# EAGLE design DBCon (EAGLE 8.1.1)
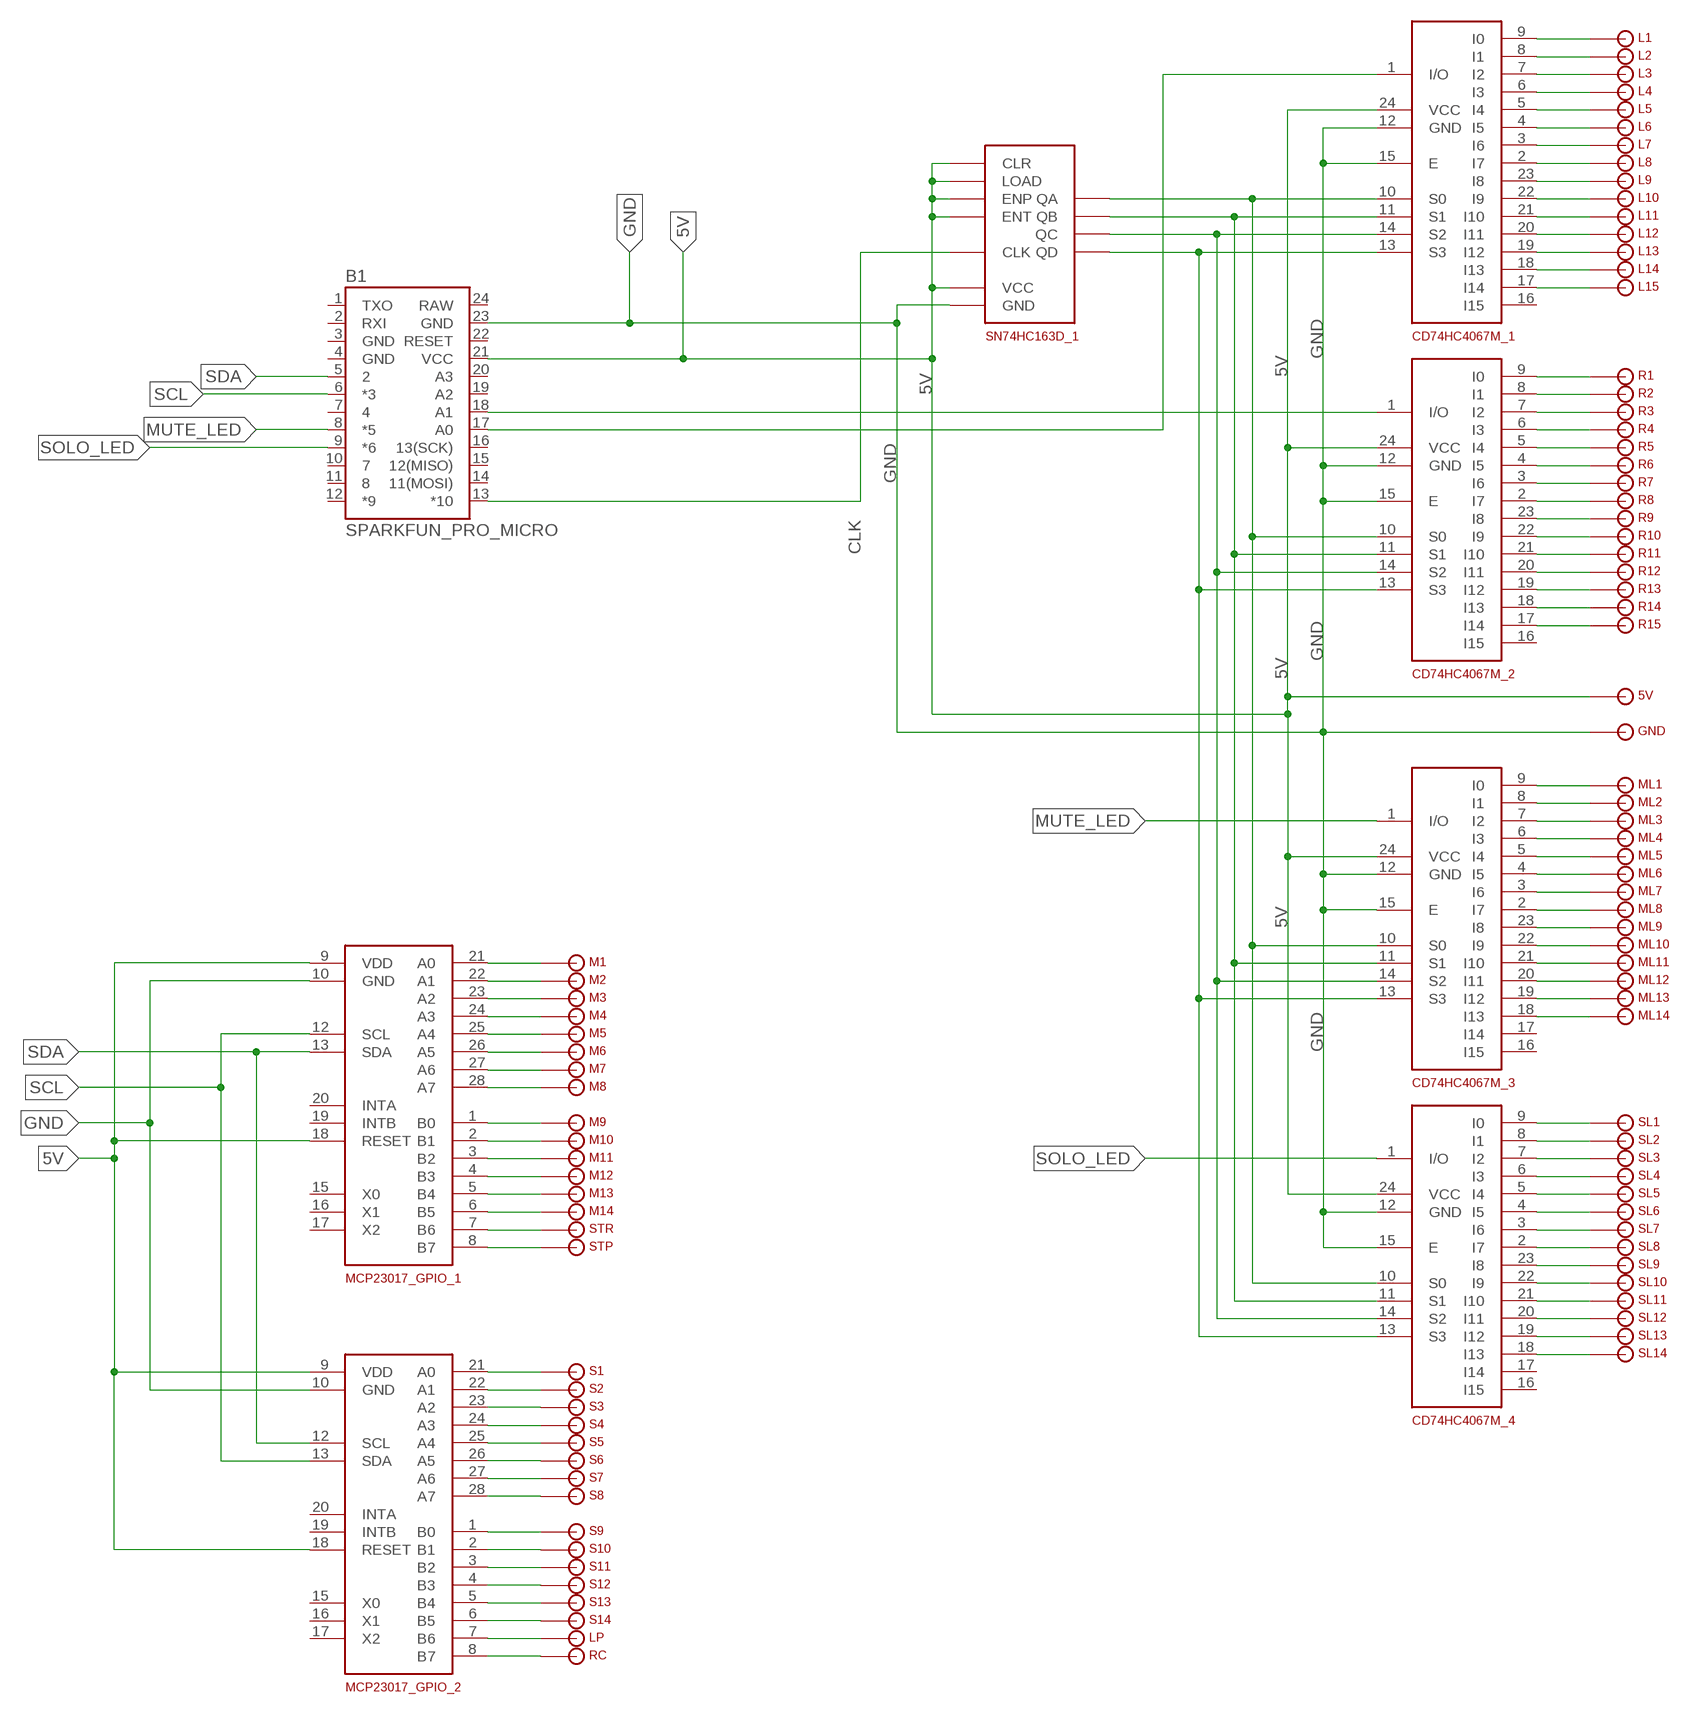
[diagram p0: schematic, sheet 1]

## Parts
5V  1_PIN  [CON1]
B1  SPARKFUN_PRO_MICRO  [SPARKFUN_PRO_MICRO]
CD74HC4067M_1  CD74HC4067M_DEMUX  [SO24]
CD74HC4067M_2  CD74HC4067M_DEMUX  [SO24]
CD74HC4067M_3  CD74HC4067M_DEMUX  [SO24]
CD74HC4067M_4  CD74HC4067M_DEMUX  [SO24]
GND  1_PIN  [CON1]
L1  1_PIN  [CON1]
L2  1_PIN  [CON1]
L3  1_PIN  [CON1]
L4  1_PIN  [CON1]
L5  1_PIN  [CON1]
L6  1_PIN  [CON1]
L7  1_PIN  [CON1]
L8  1_PIN  [CON1]
L9  1_PIN  [CON1]
L10  1_PIN  [CON1]
L11  1_PIN  [CON1]
L12  1_PIN  [CON1]
L13  1_PIN  [CON1]
L14  1_PIN  [CON1]
L15  1_PIN  [CON1]
LP  1_PIN  [CON1]
M1  1_PIN  [CON1]
M2  1_PIN  [CON1]
M3  1_PIN  [CON1]
M4  1_PIN  [CON1]
M5  1_PIN  [CON1]
M6  1_PIN  [CON1]
M7  1_PIN  [CON1]
M8  1_PIN  [CON1]
M9  1_PIN  [CON1]
M10  1_PIN  [CON1]
M11  1_PIN  [CON1]
M12  1_PIN  [CON1]
M13  1_PIN  [CON1]
M14  1_PIN  [CON1]
MCP23017_GPIO_1  MCP23017_GPIO  [DIL28-3]
MCP23017_GPIO_2  MCP23017_GPIO  [DIL28-3]
ML1  1_PIN  [CON1]
ML2  1_PIN  [CON1]
ML3  1_PIN  [CON1]
ML4  1_PIN  [CON1]
ML5  1_PIN  [CON1]
ML6  1_PIN  [CON1]
ML7  1_PIN  [CON1]
ML8  1_PIN  [CON1]
ML9  1_PIN  [CON1]
ML10  1_PIN  [CON1]
ML11  1_PIN  [CON1]
ML12  1_PIN  [CON1]
ML13  1_PIN  [CON1]
ML14  1_PIN  [CON1]
R1  1_PIN  [CON1]
R2  1_PIN  [CON1]
R3  1_PIN  [CON1]
R4  1_PIN  [CON1]
R5  1_PIN  [CON1]
R6  1_PIN  [CON1]
R7  1_PIN  [CON1]
R8  1_PIN  [CON1]
R9  1_PIN  [CON1]
R10  1_PIN  [CON1]
R11  1_PIN  [CON1]
R12  1_PIN  [CON1]
R13  1_PIN  [CON1]
R14  1_PIN  [CON1]
R15  1_PIN  [CON1]
RC  1_PIN  [CON1]
S1  1_PIN  [CON1]
S2  1_PIN  [CON1]
S3  1_PIN  [CON1]
S4  1_PIN  [CON1]
S5  1_PIN  [CON1]
S6  1_PIN  [CON1]
S7  1_PIN  [CON1]
S8  1_PIN  [CON1]
S9  1_PIN  [CON1]
S10  1_PIN  [CON1]
S11  1_PIN  [CON1]
S12  1_PIN  [CON1]
S13  1_PIN  [CON1]
S14  1_PIN  [CON1]
SL1  1_PIN  [CON1]
SL2  1_PIN  [CON1]
SL3  1_PIN  [CON1]
SL4  1_PIN  [CON1]
SL5  1_PIN  [CON1]
SL6  1_PIN  [CON1]
SL7  1_PIN  [CON1]
SL8  1_PIN  [CON1]
SL9  1_PIN  [CON1]
SL10  1_PIN  [CON1]
SL11  1_PIN  [CON1]
SL12  1_PIN  [CON1]
SL13  1_PIN  [CON1]
SL14  1_PIN  [CON1]
SN74HC163D_1  SN74HC163D_COUNTER  [SO16]
STP  1_PIN  [CON1]
STR  1_PIN  [CON1]

## Nets
5V: 5V.P$1(GND) B1.21(VCC) CD74HC4067M_1.24(VCC) CD74HC4067M_2.24(VCC) CD74HC4067M_3.24(VCC) CD74HC4067M_4.24(VCC) MCP23017_GPIO_1.9(VDD) MCP23017_GPIO_1.18(RESET) MCP23017_GPIO_2.9(VDD) MCP23017_GPIO_2.18(RESET) SN74HC163D_1.1(CLR) SN74HC163D_1.7(ENP) SN74HC163D_1.9(LOAD) SN74HC163D_1.10(ENT) SN74HC163D_1.16(VCC)
A: CD74HC4067M_1.10(S0) CD74HC4067M_2.10(S0) CD74HC4067M_3.10(S0) CD74HC4067M_4.10(S0) SN74HC163D_1.14(QA)
B: CD74HC4067M_1.11(S1) CD74HC4067M_2.11(S1) CD74HC4067M_3.11(S1) CD74HC4067M_4.11(S1) SN74HC163D_1.13(QB)
C: CD74HC4067M_1.14(S2) CD74HC4067M_2.14(S2) CD74HC4067M_3.14(S2) CD74HC4067M_4.14(S2) SN74HC163D_1.12(QC)
CLK: B1.13(*10) SN74HC163D_1.2(CLK)
D: CD74HC4067M_1.13(S3) CD74HC4067M_2.13(S3) CD74HC4067M_3.13(S3) CD74HC4067M_4.13(S3) SN74HC163D_1.11(QD)
GND: B1.23(GND) CD74HC4067M_1.12(GND) CD74HC4067M_1.15(E) CD74HC4067M_2.12(GND) CD74HC4067M_2.15(E) CD74HC4067M_3.12(GND) CD74HC4067M_3.15(E) CD74HC4067M_4.12(GND) CD74HC4067M_4.15(E) GND.P$1(GND) MCP23017_GPIO_1.10(GND) MCP23017_GPIO_2.10(GND) SN74HC163D_1.8(GND)
L_IO: B1.17(A0) CD74HC4067M_1.1(I/O)
MUTE_LED: B1.8(*5) CD74HC4067M_3.1(I/O)
N$3: M1.P$1(GND) MCP23017_GPIO_1.21(A0)
N$4: M2.P$1(GND) MCP23017_GPIO_1.22(A1)
N$6: M3.P$1(GND) MCP23017_GPIO_1.23(A2)
N$10: CD74HC4067M_3.9(I0) ML1.P$1(GND)
N$11: CD74HC4067M_3.8(I1) ML2.P$1(GND)
N$12: CD74HC4067M_3.7(I2) ML3.P$1(GND)
N$13: CD74HC4067M_3.6(I3) ML4.P$1(GND)
N$14: M4.P$1(GND) MCP23017_GPIO_1.24(A3)
N$15: M5.P$1(GND) MCP23017_GPIO_1.25(A4)
N$16: CD74HC4067M_1.9(I0) L1.P$1(GND)
N$17: CD74HC4067M_1.8(I1) L2.P$1(GND)
N$18: CD74HC4067M_1.7(I2) L3.P$1(GND)
N$19: CD74HC4067M_1.6(I3) L4.P$1(GND)
N$20: CD74HC4067M_1.5(I4) L5.P$1(GND)
N$21: CD74HC4067M_1.4(I5) L6.P$1(GND)
N$22: CD74HC4067M_1.3(I6) L7.P$1(GND)
N$23: CD74HC4067M_1.2(I7) L8.P$1(GND)
N$24: CD74HC4067M_1.23(I8) L9.P$1(GND)
N$25: CD74HC4067M_1.22(I9) L10.P$1(GND)
N$26: CD74HC4067M_1.21(I10) L11.P$1(GND)
N$27: CD74HC4067M_1.20(I11) L12.P$1(GND)
N$28: CD74HC4067M_1.19(I12) L13.P$1(GND)
N$29: CD74HC4067M_1.18(I13) L14.P$1(GND)
N$30: CD74HC4067M_1.17(I14) L15.P$1(GND)
N$31: CD74HC4067M_2.9(I0) R1.P$1(GND)
N$32: CD74HC4067M_2.8(I1) R2.P$1(GND)
N$33: CD74HC4067M_2.7(I2) R3.P$1(GND)
N$34: CD74HC4067M_2.6(I3) R4.P$1(GND)
N$35: CD74HC4067M_2.5(I4) R5.P$1(GND)
N$36: CD74HC4067M_2.4(I5) R6.P$1(GND)
N$37: CD74HC4067M_2.3(I6) R7.P$1(GND)
N$38: CD74HC4067M_2.2(I7) R8.P$1(GND)
N$39: CD74HC4067M_2.23(I8) R9.P$1(GND)
N$40: CD74HC4067M_2.22(I9) R10.P$1(GND)
N$41: CD74HC4067M_2.21(I10) R11.P$1(GND)
N$42: CD74HC4067M_2.20(I11) R12.P$1(GND)
N$43: CD74HC4067M_2.19(I12) R13.P$1(GND)
N$44: CD74HC4067M_2.18(I13) R14.P$1(GND)
N$45: CD74HC4067M_2.17(I14) R15.P$1(GND)
N$46: M6.P$1(GND) MCP23017_GPIO_1.26(A5)
N$47: M7.P$1(GND) MCP23017_GPIO_1.27(A6)
N$48: M8.P$1(GND) MCP23017_GPIO_1.28(A7)
N$49: M9.P$1(GND) MCP23017_GPIO_1.1(B0)
N$50: M10.P$1(GND) MCP23017_GPIO_1.2(B1)
N$51: M11.P$1(GND) MCP23017_GPIO_1.3(B2)
N$52: M12.P$1(GND) MCP23017_GPIO_1.4(B3)
N$53: M13.P$1(GND) MCP23017_GPIO_1.5(B4)
N$54: M14.P$1(GND) MCP23017_GPIO_1.6(B5)
N$55: MCP23017_GPIO_1.7(B6) STR.P$1(GND)
N$56: MCP23017_GPIO_1.8(B7) STP.P$1(GND)
N$57: MCP23017_GPIO_2.21(A0) S1.P$1(GND)
N$58: MCP23017_GPIO_2.22(A1) S2.P$1(GND)
N$59: MCP23017_GPIO_2.23(A2) S3.P$1(GND)
N$60: MCP23017_GPIO_2.24(A3) S4.P$1(GND)
N$61: MCP23017_GPIO_2.25(A4) S5.P$1(GND)
N$62: MCP23017_GPIO_2.26(A5) S6.P$1(GND)
N$63: MCP23017_GPIO_2.27(A6) S7.P$1(GND)
N$64: MCP23017_GPIO_2.28(A7) S8.P$1(GND)
N$65: MCP23017_GPIO_2.1(B0) S9.P$1(GND)
N$66: MCP23017_GPIO_2.2(B1) S10.P$1(GND)
N$67: MCP23017_GPIO_2.3(B2) S11.P$1(GND)
N$68: MCP23017_GPIO_2.4(B3) S12.P$1(GND)
N$69: MCP23017_GPIO_2.5(B4) S13.P$1(GND)
N$70: MCP23017_GPIO_2.6(B5) S14.P$1(GND)
N$71: LP.P$1(GND) MCP23017_GPIO_2.7(B6)
N$72: MCP23017_GPIO_2.8(B7) RC.P$1(GND)
N$73: CD74HC4067M_3.5(I4) ML5.P$1(GND)
N$74: CD74HC4067M_3.4(I5) ML6.P$1(GND)
N$75: CD74HC4067M_3.3(I6) ML7.P$1(GND)
N$76: CD74HC4067M_3.2(I7) ML8.P$1(GND)
N$77: CD74HC4067M_3.23(I8) ML9.P$1(GND)
N$78: CD74HC4067M_3.22(I9) ML10.P$1(GND)
N$79: CD74HC4067M_3.21(I10) ML11.P$1(GND)
N$80: CD74HC4067M_3.20(I11) ML12.P$1(GND)
N$81: CD74HC4067M_3.19(I12) ML13.P$1(GND)
N$82: CD74HC4067M_3.18(I13) ML14.P$1(GND)
N$83: CD74HC4067M_4.9(I0) SL1.P$1(GND)
N$84: CD74HC4067M_4.8(I1) SL2.P$1(GND)
N$85: CD74HC4067M_4.7(I2) SL3.P$1(GND)
N$86: CD74HC4067M_4.6(I3) SL4.P$1(GND)
N$87: CD74HC4067M_4.5(I4) SL5.P$1(GND)
N$88: CD74HC4067M_4.4(I5) SL6.P$1(GND)
N$89: CD74HC4067M_4.3(I6) SL7.P$1(GND)
N$90: CD74HC4067M_4.2(I7) SL8.P$1(GND)
N$91: CD74HC4067M_4.23(I8) SL9.P$1(GND)
N$92: CD74HC4067M_4.22(I9) SL10.P$1(GND)
N$93: CD74HC4067M_4.21(I10) SL11.P$1(GND)
N$94: CD74HC4067M_4.20(I11) SL12.P$1(GND)
N$95: CD74HC4067M_4.19(I12) SL13.P$1(GND)
N$96: CD74HC4067M_4.18(I13) SL14.P$1(GND)
R_IO: B1.18(A1) CD74HC4067M_2.1(I/O)
SCL: B1.6(*3) MCP23017_GPIO_1.12(SCL) MCP23017_GPIO_2.13(SDA)
SDA: B1.5 MCP23017_GPIO_1.13(SDA) MCP23017_GPIO_2.12(SCL)
SOLO_LED: B1.9(*6) CD74HC4067M_4.1(I/O)
Unconnected: B1.1(TXO) B1.2(RXI) B1.7 B1.10 B1.11 B1.12(*9) B1.14(11(MOSI)) B1.15(12(MISO)) B1.16(13(SCK)) B1.19(A2) B1.20(A3) B1.22(RESET) CD74HC4067M_1.16(I15) CD74HC4067M_2.16(I15) CD74HC4067M_3.16(I15) CD74HC4067M_3.17(I14) CD74HC4067M_4.16(I15) CD74HC4067M_4.17(I14) MCP23017_GPIO_1.15(X0) MCP23017_GPIO_1.16(X1) MCP23017_GPIO_1.17(X2) MCP23017_GPIO_1.19(INTB) MCP23017_GPIO_1.20(INTA) MCP23017_GPIO_2.15(X0) MCP23017_GPIO_2.16(X1) MCP23017_GPIO_2.17(X2) MCP23017_GPIO_2.19(INTB) MCP23017_GPIO_2.20(INTA)

## Power pins joined to a net without a drawn wire
GND: B1.3(GND) B1.4(GND)
RAW: B1.24(RAW)

## Library data of the parts
5V GND L1-L15 LP M1-M14 ML1-ML14 R1-R15 RC S1-S14 SL1-SL14 STP STR = DBCon:1_PIN
B1 = DBCon:SPARKFUN_PRO_MICRO: SparkFun Pro Micro Atmega32U4 compatible footprint. SparkFun Products: 3.3V/8MHz <https://www.sparkfun.com/products/12587> 5V/16MHz <https://www.sparkfun.com/products/12640>
CD74HC4067M_1-CD74HC4067M_4 = DBCon:CD74HC4067M_DEMUX
MCP23017_GPIO_1 MCP23017_GPIO_2 = DBCon:MCP23017_GPIO
SN74HC163D_1 = DBCon:SN74HC163D_COUNTER

## Board
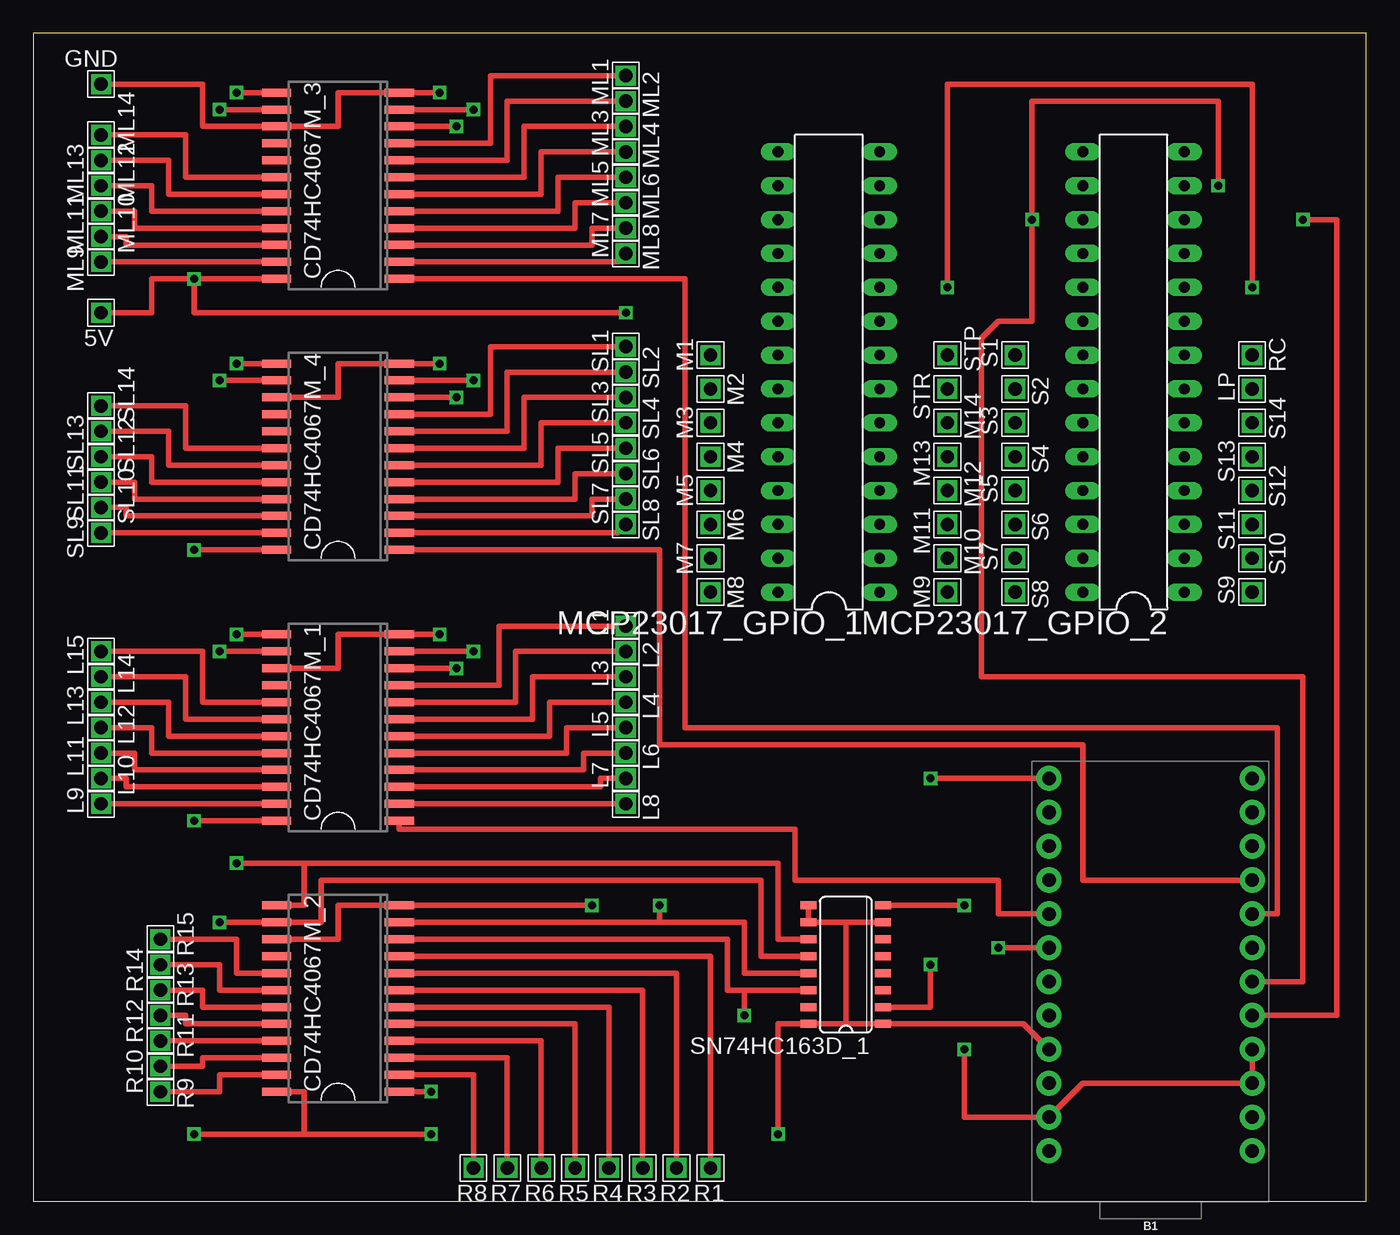
[diagram p1: board, top side]
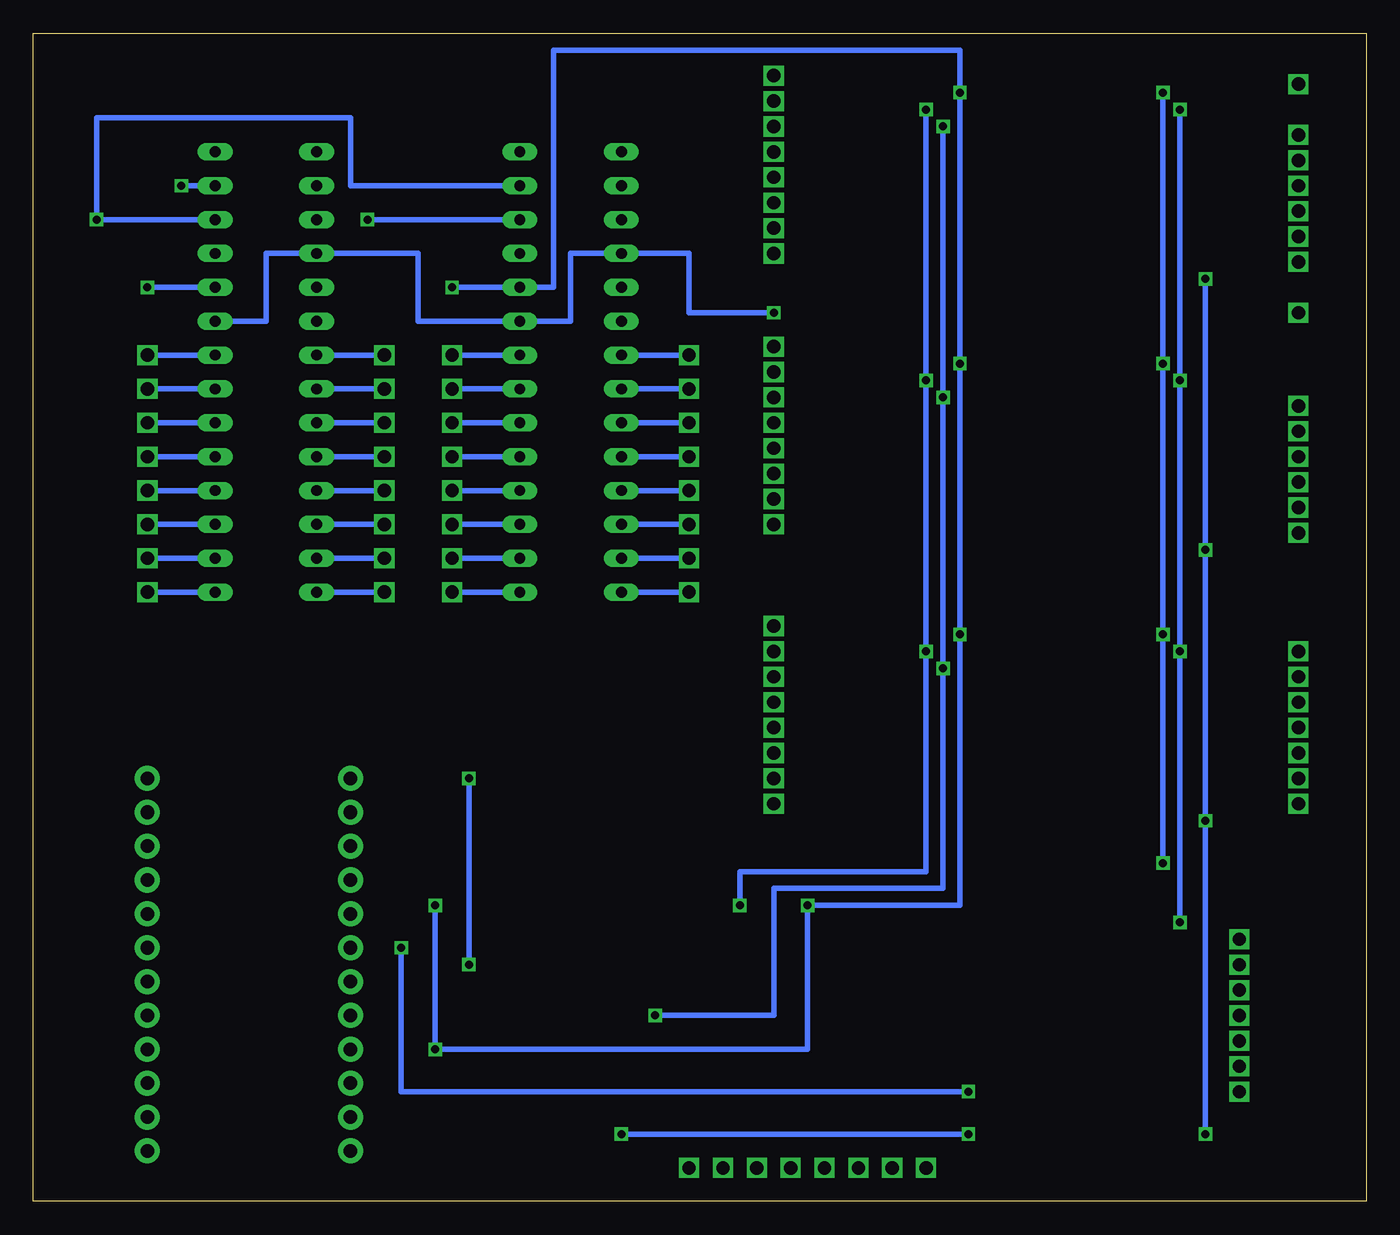
[diagram p2: board, bottom side, seen from below]

Size 100 x 87.61 mm. Coordinates in mm from the lower left corner, seen from the top.
Outline: 0,87.61 0,0 100,0 100,87.61 0,87.61
Copper layers (1*16): Top 0.035mm / dielectric 1.5mm / Bottom 0.035mm
Design rules "default": minimum track width 10mil, minimum drill 24mil, track to track 8mil, track to pad 8mil, pad to pad 8mil, via to via 8mil, smd to smd 8mil, copper to edge 40mil, drill to drill 8mil, minimum pad ring 10mil, minimum via ring 8mil, stop-mask expansion 4mil, vias tented up to drill 0mil, thermal gap 10mil

### Footprints (pad centres in the part's own frame; a part is rotated, then mirrored left to right if it is on the bottom)
CON1 = drill 1 square: P$1 0,0
SPARKFUN_PRO_MICRO = drill 1.016 pad 1.88: 1 -7.62,12.7; 2 -7.62,10.16; 3 -7.62,7.62; 4 -7.62,5.08; 5 -7.62,2.54; 6 -7.62,0; 7 -7.62,-2.54; 8 -7.62,-5.08; 9 -7.62,-7.62; 10 -7.62,-10.16; 11 -7.62,-12.7; 12 -7.62,-15.24; 13 7.62,-15.24; 14 7.62,-12.7; 15 7.62,-10.16; 16 7.62,-7.62; 17 7.62,-5.08; 18 7.62,-2.54; 19 7.62,0; 20 7.62,2.54; 21 7.62,5.08; 22 7.62,7.62; 23 7.62,10.16; 24 7.62,12.7
SO24 = smd 0.6 x 2.2: 1 -6.985,-4.6; 2 -5.715,-4.6; 3 -4.445,-4.6; 4 -3.175,-4.6; 5 -1.905,-4.6; 6 -0.635,-4.6; 7 0.635,-4.6; 8 1.905,-4.6; 9 3.175,-4.6; 10 4.445,-4.6; 11 5.715,-4.6; 12 6.985,-4.6; 13 6.985,4.6; 14 5.715,4.6; 15 4.445,4.6; 16 3.175,4.6; 17 1.905,4.6; 18 0.635,4.6; 19 -0.635,4.6; 20 -1.905,4.6; 21 -3.175,4.6; 22 -4.445,4.6; 23 -5.715,4.6; 24 -6.985,4.6
DIL28-3 = drill 0.813 long: 1 -16.51,-3.81; 2 -13.97,-3.81; 3 -11.43,-3.81; 4 -8.89,-3.81; 5 -6.35,-3.81; 6 -3.81,-3.81; 7 -1.27,-3.81; 8 1.27,-3.81; 9 3.81,-3.81; 10 6.35,-3.81; 11 8.89,-3.81; 12 11.43,-3.81; 13 13.97,-3.81; 14 16.51,-3.81; 15 16.51,3.81; 16 13.97,3.81; 17 11.43,3.81; 18 8.89,3.81; 19 6.35,3.81; 20 3.81,3.81; 21 1.27,3.81; 22 -1.27,3.81; 23 -3.81,3.81; 24 -6.35,3.81; 25 -8.89,3.81; 26 -11.43,3.81; 27 -13.97,3.81; 28 -16.51,3.81
SO16 = smd 0.6 x 1.2: 1 -4.445,-2.8; 2 -3.175,-2.8; 3 -1.905,-2.8; 4 -0.635,-2.8; 5 0.635,-2.8; 6 1.905,-2.8; 7 3.175,-2.8; 8 4.445,-2.8; 9 4.445,2.8; 10 3.175,2.8; 11 1.905,2.8; 12 0.635,2.8; 13 -0.635,2.8; 14 -1.905,2.8; 15 -3.175,2.8; 16 -4.445,2.8

### Placement (x,y rotation side)
5V  5.08,66.66 0 top
B1  83.82,16.49 180 top
CD74HC4067M_1  22.86,35.54 90 top
CD74HC4067M_2  22.86,15.22 90 top
CD74HC4067M_3  22.86,76.18 90 top
CD74HC4067M_4  22.86,55.86 90 top
GND  5.08,83.8 180 top
L1  44.45,43.16 270 top
L2  44.45,41.26 90 top
L3  44.45,39.35 270 top
L4  44.45,37.45 90 top
L5  44.45,35.54 270 top
L6  44.45,33.63 90 top
L7  44.45,31.73 270 top
L8  44.45,29.82 90 top
L9  5.08,29.82 270 top
L10  5.08,31.73 90 top
L11  5.08,33.63 270 top
L12  5.08,35.54 90 top
L13  5.08,37.45 270 top
L14  5.08,39.35 90 top
L15  5.08,41.26 270 top
LP  91.44,60.94 270 top
M1  50.8,63.48 270 top
M2  50.8,60.94 90 top
M3  50.8,58.4 270 top
M4  50.8,55.86 90 top
M5  50.8,53.32 270 top
M6  50.8,50.78 90 top
M7  50.8,48.24 270 top
M8  50.8,45.7 90 top
M9  68.58,45.7 270 top
M10  68.58,48.24 90 top
M11  68.58,50.78 270 top
M12  68.58,53.32 90 top
M13  68.58,55.86 270 top
M14  68.58,58.4 90 top
MCP23017_GPIO_1  59.69,62.21 90 top
MCP23017_GPIO_2  82.55,62.21 90 top
ML1  44.45,84.44 270 top
ML2  44.45,82.53 90 top
ML3  44.45,80.62 270 top
ML4  44.45,78.72 90 top
ML5  44.45,76.81 270 top
ML6  44.45,74.91 90 top
ML7  44.45,73 270 top
ML8  44.45,71.1 90 top
ML9  5.08,70.47 270 top
ML10  5.08,72.37 90 top
ML11  5.08,74.28 270 top
ML12  5.08,76.18 90 top
ML13  5.08,78.08 270 top
ML14  5.08,79.99 90 top
R1  50.8,2.52 0 top
R2  48.26,2.52 0 top
R3  45.72,2.52 0 top
R4  43.18,2.52 0 top
R5  40.64,2.52 0 top
R6  38.1,2.52 0 top
R7  35.56,2.52 0 top
R8  33.02,2.52 0 top
R9  9.53,8.23 90 top
R10  9.53,10.14 270 top
R11  9.53,12.04 90 top
R12  9.53,13.95 270 top
R13  9.53,15.86 90 top
R14  9.53,17.76 270 top
R15  9.53,19.66 90 top
RC  91.44,63.48 90 top
S1  73.66,63.48 270 top
S2  73.66,60.94 90 top
S3  73.66,58.4 270 top
S4  73.66,55.86 90 top
S5  73.66,53.32 270 top
S6  73.66,50.78 90 top
S7  73.66,48.24 270 top
S8  73.66,45.7 90 top
S9  91.44,45.7 270 top
S10  91.44,48.24 90 top
S11  91.44,50.78 270 top
S12  91.44,53.32 90 top
S13  91.44,55.86 270 top
S14  91.44,58.4 90 top
SL1  44.45,64.12 270 top
SL2  44.45,62.21 90 top
SL3  44.45,60.3 270 top
SL4  44.45,58.4 90 top
SL5  44.45,56.49 270 top
SL6  44.45,54.59 90 top
SL7  44.45,52.69 270 top
SL8  44.45,50.78 90 top
SL9  5.08,50.15 270 top
SL10  5.08,52.05 90 top
SL11  5.08,53.95 270 top
SL12  5.08,55.86 90 top
SL13  5.08,57.77 270 top
SL14  5.08,59.67 90 top
SN74HC163D_1  60.96,17.76 90 top
STP  68.58,63.48 90 top
STR  68.58,60.94 270 top

### Tracks (layer width: path | path; a pad name or v marks a point on that pad's centre or on a via)
5V  (via drill 0.6)
  Top 0.406: 60.96,13.31 SN74HC163D_1.1 74.3,13.31 B1.21 | 60.96,13.31 SN74HC163D_1.16 55.88,13.31 v55.88,5.06 | 60.96,20.93 SN74HC163D_1.10 SN74HC163D_1.9 | 60.96,20.93 SN74HC163D_1.7 | 60.96,20.93 60.96,13.31 | CD74HC4067M_2.24 20.32,8.23 20.32,5.06 | 20.32,5.06 v29.84,5.06 | CD74HC4067M_1.24 v12.06,28.55 | v12.06,5.06 20.32,5.06 | v12.06,48.88 CD74HC4067M_4.24 | CD74HC4067M_3.24 v12.06,69.19 | 5V.P$1 8.89,66.66 8.89,69.19 v12.06,69.19 | v12.06,69.19 12.06,66.66 v44.45,66.66
  Bottom 0.406: v29.84,5.06 v55.88,5.06 | v12.06,5.06 v12.06,28.55 v12.06,48.88 v12.06,69.19 | v44.45,66.66 50.8,66.66 50.8,71.1 MCP23017_GPIO_1.18 59.69,71.1 59.69,66.02 MCP23017_GPIO_1.9 71.12,66.02 71.12,71.1 MCP23017_GPIO_2.18 82.55,71.1 82.55,66.02 MCP23017_GPIO_2.9
A  (via drill 0.6)
  Top 0.406: SN74HC163D_1.14 53.34,15.86 | 53.34,15.86 52.07,15.86 52.07,19.66 CD74HC4067M_2.10 | 53.34,15.86 v53.34,13.95 | v31.75,39.98 CD74HC4067M_1.10 | v31.75,60.3 CD74HC4067M_4.10 | v31.75,80.62 CD74HC4067M_3.10
  Bottom 0.406: v53.34,13.95 44.45,13.95 44.45,23.48 31.75,23.48 v31.75,39.98 v31.75,60.3 v31.75,80.62
B  (via drill 0.6)
  Top 0.406: SN74HC163D_1.13 53.34,17.12 53.34,20.93 46.99,20.93 | 46.99,20.93 CD74HC4067M_2.11 | 46.99,20.93 v46.99,22.2 | v33.02,41.26 CD74HC4067M_1.11 | v33.02,61.58 CD74HC4067M_4.11 | v33.02,81.89 CD74HC4067M_3.11
  Bottom 0.406: v46.99,22.2 46.99,24.75 33.02,24.75 v33.02,41.26 v33.02,61.58 v33.02,81.89
C  (via drill 0.6)
  Top 0.406: SN74HC163D_1.12 54.61,18.39 54.61,24.11 21.59,24.11 21.59,20.93 CD74HC4067M_2.14 v13.97,20.93 | v13.97,41.26 CD74HC4067M_1.14 | v13.97,61.58 CD74HC4067M_4.14 | v13.97,81.89 CD74HC4067M_3.14
  Bottom 0.406: v13.97,20.93 v13.97,41.26 v13.97,61.58 v13.97,81.89
CLK  (via drill 0.6)
  Top 0.406: SN74HC163D_1.2 67.31,14.59 v67.31,17.76 | v67.31,31.73 B1.13
  Bottom 0.406: v67.31,17.76 v67.31,31.73
D  (via drill 0.6)
  Top 0.406: SN74HC163D_1.11 55.88,19.66 55.88,25.38 20.32,25.38 | 20.32,25.38 20.32,22.2 CD74HC4067M_2.13 | 20.32,25.38 v15.24,25.38 | v15.24,42.52 CD74HC4067M_1.13 | v15.24,62.84 CD74HC4067M_4.13 | v15.24,83.17 CD74HC4067M_3.13
  Bottom 0.406: v15.24,25.38 v15.24,42.52 v15.24,62.84 v15.24,83.17
GND  (via drill 0.6)
  Top 0.406: v69.85,11.41 69.85,6.33 B1.23 78.74,8.87 B1.3 B1.4 | v69.85,22.2 SN74HC163D_1.8 | v41.91,22.2 CD74HC4067M_2.12 22.86,22.2 22.86,19.66 CD74HC4067M_2.15 | v30.48,42.52 CD74HC4067M_1.12 22.86,42.52 22.86,39.98 CD74HC4067M_1.15 | v30.48,62.84 CD74HC4067M_4.12 22.86,62.84 22.86,60.3 CD74HC4067M_4.15 | v30.48,83.17 CD74HC4067M_3.12 22.86,83.17 22.86,80.62 CD74HC4067M_3.15 12.7,80.62 12.7,83.8 GND.P$1 | v68.58,68.56 68.58,83.8 91.44,83.8 v91.44,68.56
  Bottom 0.406: v69.85,22.2 v69.85,11.41 41.91,11.41 v41.91,22.2 30.48,22.2 v30.48,42.52 v30.48,62.84 v30.48,83.17 30.48,86.34 60.96,86.34 60.96,68.56 MCP23017_GPIO_1.10 v68.58,68.56 | v91.44,68.56 MCP23017_GPIO_2.10
L_IO
  Top 0.406: CD74HC4067M_1.1 27.46,27.92 57.15,27.92 57.15,24.11 72.39,24.11 72.39,21.57 B1.17
MUTE_LED
  Top 0.406: B1.8 93.34,21.57 93.34,35.54 48.9,35.54 48.9,69.19 CD74HC4067M_3.1
N$3
  Bottom 0.406: M1.P$1 MCP23017_GPIO_1.21
N$4
  Bottom 0.406: MCP23017_GPIO_1.22 M2.P$1
N$6
  Bottom 0.406: M3.P$1 MCP23017_GPIO_1.23
N$10
  Top 0.406: CD74HC4067M_3.9 34.29,79.36 34.29,84.44 ML1.P$1
N$11
  Top 0.406: CD74HC4067M_3.8 35.56,78.08 35.56,82.53 ML2.P$1
N$12
  Top 0.406: CD74HC4067M_3.7 36.83,76.81 36.83,80.62 ML3.P$1
N$13
  Top 0.406: CD74HC4067M_3.6 38.1,75.55 38.1,78.72 ML4.P$1
N$14
  Bottom 0.406: MCP23017_GPIO_1.24 M4.P$1
N$15
  Bottom 0.406: M5.P$1 MCP23017_GPIO_1.25
N$16
  Top 0.406: CD74HC4067M_1.9 34.93,38.72 34.93,43.16 L1.P$1
N$17
  Top 0.406: CD74HC4067M_1.8 36.2,37.45 36.2,41.26 L2.P$1
N$18
  Top 0.406: CD74HC4067M_1.7 37.47,36.17 37.47,39.35 L3.P$1
N$19
  Top 0.406: CD74HC4067M_1.6 38.73,34.91 38.73,37.45 L4.P$1
N$20
  Top 0.406: CD74HC4067M_1.5 40.01,33.63 40.01,35.54 L5.P$1
N$21
  Top 0.406: CD74HC4067M_1.4 41.27,32.36 41.27,33.63 L6.P$1
N$22
  Top 0.406: CD74HC4067M_1.3 42.55,31.09 42.55,31.73 L7.P$1
N$23
  Top 0.406: CD74HC4067M_1.2 L8.P$1
N$24
  Top 0.406: L9.P$1 CD74HC4067M_1.23
N$25
  Top 0.406: CD74HC4067M_1.22 6.98,31.09 6.98,31.73 L10.P$1
N$26
  Top 0.406: CD74HC4067M_1.21 7.62,32.36 7.62,33.63 L11.P$1
N$27
  Top 0.406: CD74HC4067M_1.20 8.89,33.63 8.89,35.54 L12.P$1
N$28
  Top 0.406: CD74HC4067M_1.19 10.16,34.91 10.16,37.45 L13.P$1
N$29
  Top 0.406: CD74HC4067M_1.18 11.43,36.17 11.43,39.35 L14.P$1
N$30
  Top 0.406: CD74HC4067M_1.17 12.7,37.45 12.7,41.26 L15.P$1
N$31
  Top 0.406: CD74HC4067M_2.9 50.8,18.39 R1.P$1
N$32
  Top 0.406: CD74HC4067M_2.8 48.26,17.12 R2.P$1
N$33
  Top 0.406: CD74HC4067M_2.7 45.72,15.86 R3.P$1
N$34
  Top 0.406: CD74HC4067M_2.6 43.18,14.59 R4.P$1
N$35
  Top 0.406: CD74HC4067M_2.5 40.64,13.31 R5.P$1
N$36
  Top 0.406: CD74HC4067M_2.4 38.1,12.04 R6.P$1
N$37
  Top 0.406: CD74HC4067M_2.3 35.56,10.78 R7.P$1
N$38
  Top 0.406: CD74HC4067M_2.2 33.02,9.51 R8.P$1
N$39
  Top 0.406: CD74HC4067M_2.23 13.97,9.51 13.97,8.23 R9.P$1
N$40
  Top 0.406: CD74HC4067M_2.22 12.7,10.78 12.7,10.14 R10.P$1
N$41
  Top 0.406: CD74HC4067M_2.21 R11.P$1
N$42
  Top 0.406: CD74HC4067M_2.20 11.43,13.31 11.43,13.95 R12.P$1
N$43
  Top 0.406: CD74HC4067M_2.19 12.7,14.59 12.7,15.86 R13.P$1
N$44
  Top 0.406: CD74HC4067M_2.18 13.97,15.86 13.97,17.76 R14.P$1
N$45
  Top 0.406: CD74HC4067M_2.17 15.24,17.12 15.24,19.66 R15.P$1
N$46
  Bottom 0.406: MCP23017_GPIO_1.26 M6.P$1
N$47
  Bottom 0.406: M7.P$1 MCP23017_GPIO_1.27
N$48
  Bottom 0.406: MCP23017_GPIO_1.28 M8.P$1
N$49
  Bottom 0.406: M9.P$1 MCP23017_GPIO_1.1
N$50
  Bottom 0.406: MCP23017_GPIO_1.2 M10.P$1
N$51
  Bottom 0.406: M11.P$1 MCP23017_GPIO_1.3
N$52
  Bottom 0.406: MCP23017_GPIO_1.4 M12.P$1
N$53
  Bottom 0.406: M13.P$1 MCP23017_GPIO_1.5
N$54
  Bottom 0.406: MCP23017_GPIO_1.6 M14.P$1
N$55
  Bottom 0.406: STR.P$1 MCP23017_GPIO_1.7
N$56
  Bottom 0.406: MCP23017_GPIO_1.8 STP.P$1
N$57
  Bottom 0.406: MCP23017_GPIO_2.21 S1.P$1
N$58
  Bottom 0.406: S2.P$1 MCP23017_GPIO_2.22
N$59
  Bottom 0.406: MCP23017_GPIO_2.23 S3.P$1
N$60
  Bottom 0.406: S4.P$1 MCP23017_GPIO_2.24
N$61
  Bottom 0.406: MCP23017_GPIO_2.25 S5.P$1
N$62
  Bottom 0.406: S6.P$1 MCP23017_GPIO_2.26
N$63
  Bottom 0.406: MCP23017_GPIO_2.27 S7.P$1
N$64
  Bottom 0.406: S8.P$1 MCP23017_GPIO_2.28
N$65
  Bottom 0.406: MCP23017_GPIO_2.1 S9.P$1
N$66
  Bottom 0.406: S10.P$1 MCP23017_GPIO_2.2
N$67
  Bottom 0.406: MCP23017_GPIO_2.3 S11.P$1
N$68
  Bottom 0.406: S12.P$1 MCP23017_GPIO_2.4
N$69
  Bottom 0.406: MCP23017_GPIO_2.5 S13.P$1
N$70
  Bottom 0.406: S14.P$1 MCP23017_GPIO_2.6
N$71
  Bottom 0.406: MCP23017_GPIO_2.7 LP.P$1
N$72
  Bottom 0.406: RC.P$1 MCP23017_GPIO_2.8
N$73
  Top 0.406: CD74HC4067M_3.5 39.37,74.28 39.37,76.81 ML5.P$1
N$74
  Top 0.406: CD74HC4067M_3.4 40.64,73 40.64,74.91 ML6.P$1
N$75
  Top 0.406: CD74HC4067M_3.3 41.91,71.73 41.91,73 ML7.P$1
N$76
  Top 0.406: CD74HC4067M_3.2 43.82,70.47 ML8.P$1
N$77
  Top 0.406: ML9.P$1 CD74HC4067M_3.23
N$78
  Top 0.406: CD74HC4067M_3.22 6.98,71.73 6.98,72.37 ML10.P$1
N$79
  Top 0.406: CD74HC4067M_3.21 7.62,73 7.62,74.28 ML11.P$1
N$80
  Top 0.406: CD74HC4067M_3.20 8.89,74.28 8.89,76.18 ML12.P$1
N$81
  Top 0.406: CD74HC4067M_3.19 10.16,75.55 10.16,78.08 ML13.P$1
N$82
  Top 0.406: CD74HC4067M_3.18 11.43,76.81 11.43,79.99 ML14.P$1
N$83
  Top 0.406: CD74HC4067M_4.9 34.29,59.03 34.29,64.12 SL1.P$1
N$84
  Top 0.406: CD74HC4067M_4.8 35.56,57.77 35.56,62.21 SL2.P$1
N$85
  Top 0.406: CD74HC4067M_4.7 36.83,56.49 36.83,60.3 SL3.P$1
N$86
  Top 0.406: CD74HC4067M_4.6 38.1,55.23 38.1,58.4 SL4.P$1
N$87
  Top 0.406: CD74HC4067M_4.5 39.37,53.95 39.37,56.49 SL5.P$1
N$88
  Top 0.406: CD74HC4067M_4.4 40.64,52.69 40.64,54.59 SL6.P$1
N$89
  Top 0.406: CD74HC4067M_4.3 41.91,51.41 41.91,52.69 SL7.P$1
N$90
  Top 0.406: CD74HC4067M_4.2 43.82,50.15 SL8.P$1
N$91
  Top 0.406: CD74HC4067M_4.23 SL9.P$1
N$92
  Top 0.406: CD74HC4067M_4.22 6.98,51.41 6.98,52.05 SL10.P$1
N$93
  Top 0.406: CD74HC4067M_4.21 7.62,52.69 7.62,53.95 SL11.P$1
N$94
  Top 0.406: CD74HC4067M_4.20 8.89,53.95 8.89,55.86 SL12.P$1
N$95
  Top 0.406: CD74HC4067M_4.19 10.16,55.23 10.16,57.77 SL13.P$1
N$96
  Top 0.406: CD74HC4067M_4.18 11.43,56.49 11.43,59.67 SL14.P$1
R_IO  (via drill 0.6)
  Top 0.406: CD74HC4067M_2.1 v29.84,8.23 | v72.39,19.03 B1.18
  Bottom 0.406: v29.84,8.23 72.39,8.23 v72.39,19.03
SCL  (via drill 0.6)
  Top 0.406: v88.9,76.18 88.9,82.53 74.93,82.53 v74.93,73.64 74.93,66.02 72.39,66.02 71.12,64.75 71.12,39.35 95.25,39.35 95.25,16.49 B1.6
  Bottom 0.406: MCP23017_GPIO_2.13 v88.9,76.18 | v74.93,73.64 MCP23017_GPIO_1.12
SDA  (via drill 0.6)
  Top 0.406: B1.5 97.79,13.95 97.79,73.64 v95.25,73.64
  Bottom 0.406: MCP23017_GPIO_1.13 76.2,76.18 76.2,81.26 95.25,81.26 v95.25,73.64 MCP23017_GPIO_2.12
SOLO_LED
  Top 0.406: B1.9 78.74,24.11 78.74,34.27 46.99,34.27 46.99,48.88 CD74HC4067M_4.1